# EAGLE schematic circuito_controle (EAGLE 9.6.2)
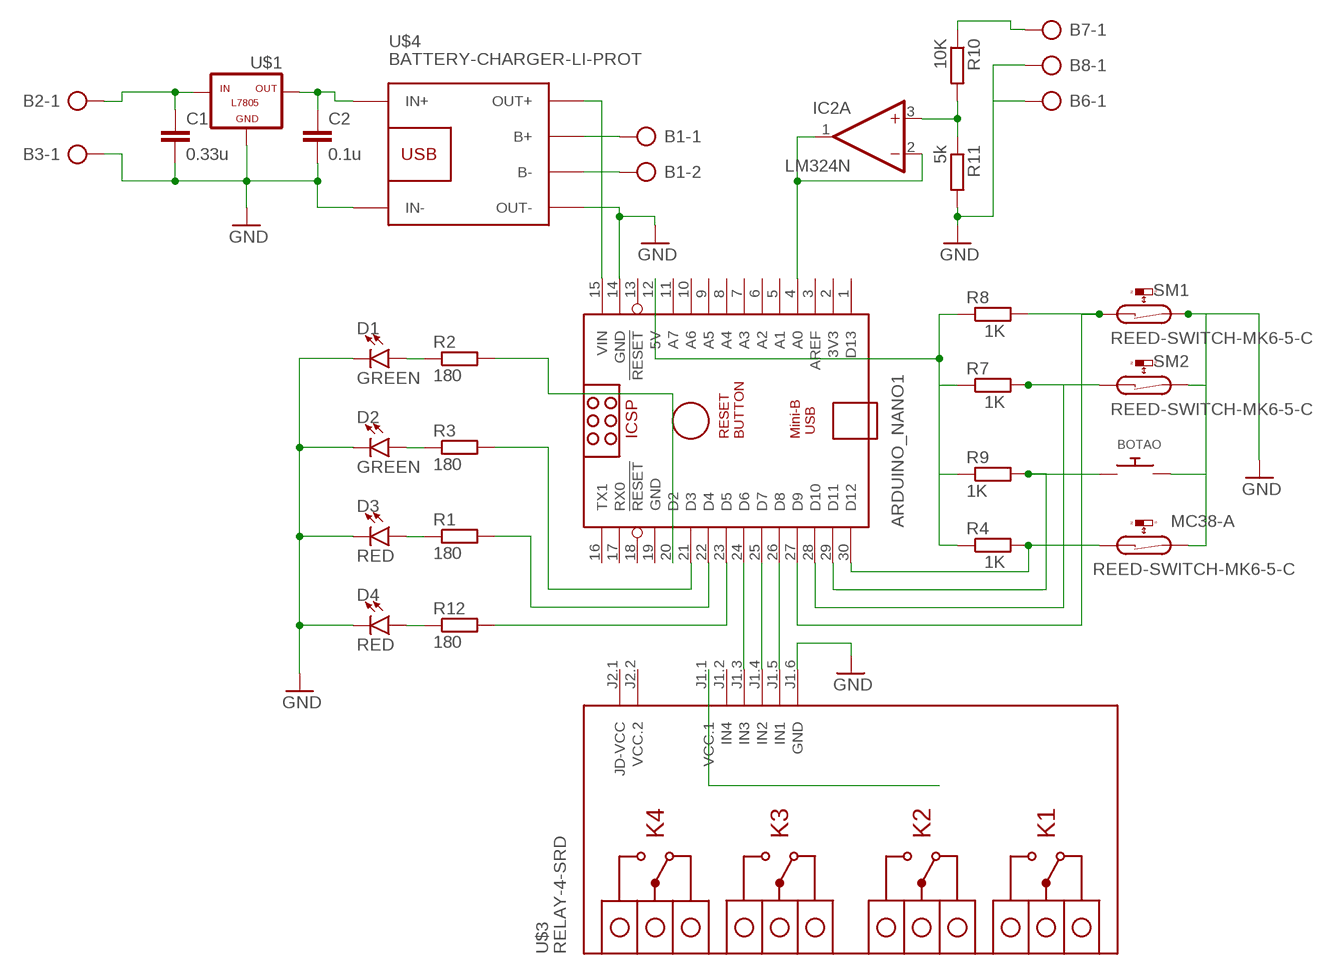
[diagram p0: schematic, sheet 1]

## Parts
ARDUINO_NANO1  ARDUINO_NANO  [ARDUINO_NANO]
B1  AK500/2-H  [AK500/2-H]
B2  AK500/2-H  [AK500/2-H]
B3  AK500/2-H  [AK500/2-H]
B6  AK500/2-H  [AK500/2-H]
B7  AK500/2-H  [AK500/2-H]
B8  AK500/2-H  [AK500/2-H]
BOTAO  SWITCH_PUSHBUTTONC&K_KSS  [BTN_CK_KSS]
C1  0.33u  C2.5/4  [C2.5-4]
C2  0.1u  C2.5/4  [C2.5-4]
D1  GREEN  LED-GREEN0603  [LED-0603]
D2  GREEN  LED-GREEN0603  [LED-0603]
D3  RED  LED-RED0603  [LED-0603]
D4  RED  LED-RED0603  [LED-0603]
IC2  LM324N  [DIL14]
MC38-A  REED-SWITCH-MK6-5-C  [MK6-5]
R1  180  R-EU_0204/5  [0204/5]
R2  180  R-EU_0204/5  [0204/5]
R3  180  R-EU_0204/5  [0204/5]
R4  1K  R-EU_0204/7  [0204/7]
R7  1K  R-EU_0204/7  [0204/7]
R8  1K  R-EU_0204/7  [0204/7]
R9  1K  R-EU_0204/7  [0204/7]
R10  10K  R-EU_0204/7  [0204/7]
R11  5k  R-EU_0204/7  [0204/7]
R12  180  R-EU_0204/5  [0204/5]
SM1  REED-SWITCH-MK6-5-C  [MK6-5]
SM2  REED-SWITCH-MK6-5-C  [MK6-5]
U$1  -L7805  [L7805]
U$3  RELAY-4-SRD  [RELAY-4-SRD]
U$4  BATTERY-CHARGER-LI-PROT  [BATTERY-CHARGER-LI-PROT]

## Nets
GND: ARDUINO_NANO1.14(GND) B3.1 B6.1 B8.1 BOTAO.P$2 C1.2 C2.2 D1.C D2.C D3.C D4.C MC38-A.2 R11.2 SM1.2 SM2.2 U$1.GND U$3.J1.6(GND) U$4.IN- U$4.OUT-
N$1: B1.2 U$4.B-
N$2: ARDUINO_NANO1.15(VIN) U$4.OUT+
N$3: B2.1 C1.1 U$1.IN
N$4: C2.1 U$1.OUT U$4.IN+
N$5: ARDUINO_NANO1.24(D6) U$3.J1.3(IN3)
N$6: ARDUINO_NANO1.25(D7) U$3.J1.4(IN2)
N$7: ARDUINO_NANO1.21(D3) R3.2
N$8: ARDUINO_NANO1.29(D11) BOTAO.P$1 R9.2
N$9: ARDUINO_NANO1.26(D8) U$3.J1.5(IN1)
N$10: D1.A R2.1
N$11: D2.A R3.1
N$12: D3.A R1.1
N$13: U$3.J1.1(VCC.1)
N$14: ARDUINO_NANO1.27(D9) R8.2 SM1.1
N$15: ARDUINO_NANO1.22(D4) R1.2
N$16: ARDUINO_NANO1.23(D5) R12.2
N$17: D4.A R12.1
N$18: ARDUINO_NANO1.20(D2) R2.2
N$19: ARDUINO_NANO1.4(A0) IC2.1(A:OUT) IC2.2(A:-IN)
N$20: ARDUINO_NANO1.28(D10) R7.2 SM2.1
N$23: B7.1 R10.1
N$25: ARDUINO_NANO1.12(5V) R4.1 R7.1 R8.1 R9.1
N$26: ARDUINO_NANO1.30(D12) MC38-A.1 R4.2
N$43: B1.1 U$4.B+
N$45: IC2.3(A:+IN) R10.2 R11.1
Unconnected: ARDUINO_NANO1.1(D13) ARDUINO_NANO1.2(3V3) ARDUINO_NANO1.3(AREF) ARDUINO_NANO1.5(A1) ARDUINO_NANO1.6(A2) ARDUINO_NANO1.7(A3) ARDUINO_NANO1.8(A4) ARDUINO_NANO1.9(A5) ARDUINO_NANO1.10(A6) ARDUINO_NANO1.11(A7) ARDUINO_NANO1.13(!RESET) ARDUINO_NANO1.16(TX1) ARDUINO_NANO1.17(RX0) ARDUINO_NANO1.18(!RESET) B2.2 B3.2 B6.2 B7.2 B8.2 IC2.5(B:+IN) IC2.6(B:-IN) IC2.7(B:OUT) IC2.8(C:OUT) IC2.9(C:-IN) IC2.10(C:+IN) IC2.12(D:+IN) IC2.13(D:-IN) IC2.14(D:OUT) U$3.J1.2(IN4) U$3.J2.1(JD-VCC)

## Power pins joined to a net without a drawn wire
GND: ARDUINO_NANO1.19(GND)
V+: IC2.4(P:V+)
V-: IC2.11(P:V-)
VCC.2: U$3.J2.2(VCC.2)

## Library data of the parts
ARDUINO_NANO1 = ArduinoNanoV30:ARDUINO_NANO: Arduino Nano V3.0 Overview: The Arduino Nano is a small, complete, and breadboard-friendly board based on the ATmega328 (Arduino Nano 3.x) or ATmega168 (Arduino Nano 2.x). It has more or less the same functionality of the Arduino Duemilanove, but in a different package. It lacks only a DC power jack, and works with a Mini-B USB cable instead of a standard one. The Nano was designed and is being produced by Gravitech. Specifications: Microcontroller Atmel ATmega168 or ATmega328 Operating Voltage (logic level) 5 V Input Voltage (recommended) 7-12 V Input Voltage (limits) 6-20 V Digital I/O Pins 14 (of which 6 provide PWM output) Analog Input Pins 8 DC Current per I/O Pin 40 mA Flash Memory 16 KB (ATmega168) or 32 KB (ATmega328) of which 2 KB used by bootloader SRAM 1 KB (ATmega168) or 2 KB (ATmega328) EEPROM 512 bytes (ATmega168) or 1 KB (ATmega328) Clock Speed 16 MHz Dimensions 0.73" x 1.70" Length 45 mm Width 18 mm Weigth 5 g Power: The Arduino Nano can be powered via the Mini-B USB connection, 6-20V unregulated external power supply (pin 30), or 5V regulated external power supply (pin 27). The power source is automatically selected to the highest voltage source. Memory: The ATmega168 has 16 KB of flash memory for storing code (of which 2 KB is used for the bootloader); the ATmega328 has 32 KB, (also with 2 KB used for the bootloader). The ATmega168 has 1 KB of SRAM and 512 bytes of EEPROM (which can be read and written with the EEPROM library); the ATmega328 has 2 KB of SRAM and 1 KB of EEPROM. Input and Output: Each of the 14 digital pins on the Nano can be used as an input or output, using pinMode(), digitalWrite(), and digitalRead() functions. They operate at 5 volts. Each pin can provide or receive a maximum of 40 mA and has an internal pull-up resistor (disconnected by default) of 20-50 kOhms. In addition, some pins have specialized functions. Visit Arduino - ArduinoBoardNano <https://www.arduino.cc/en/Main/ArduinoBoardNano>
B1-B3 B6-B8 = con-ptr500:AK500/2-H: CONNECTOR Aug. 2004 / PTR Meßtechnik: Die Bezeichnung der Serie AK505 wurde geändert. Es handelt sich hierbei um AK500 in horizontaler Ausführung.; OC_FARNELL: unknown; OC_NEWARK: unknown
BOTAO = adafruit:SWITCH_PUSHBUTTON: Buttons SOFTTOUCHSMD_SJ - Soft touch temporary push button (Super Junk Akihabara) Compatible with SKPMANE010 [Mouser: 688-SKPMAN] C&K_KSS = Digikey: KSS221GLFS
C1 C2 = capacitor-wima:C: CAPACITOR naming: grid - package width
D1 D2 = SparkFun-LED:LED-GREEN: Green SMD LED Used in manufacturing of various products at SparkFun Packages: 0603 - SMD 0603 package [Product Link] <http://www.futureelectronics.com/en/technologies/semiconductors/optoelectronics/leds/Pages/9894312-LTST-C190GKT.aspx?CrossPart=HSMG-C190&IM=0> LilyPad 1206 - SMD1206 LilyPad package [Product Link] <http://www.futureelectronics.com/en/Technologies/Product.aspx?ProductID=IN150NGHARVATEKCORPORATION2049943&IM=0> 1206 - SMD1206 package [Product Link] <http://www.futureelectronics.com/en/technologies/semiconductors/optoelectronics/leds/Pages/8315665-LTST-C150KGKT.aspx?IM=0> 1206 Bottom Mount -SMD 1206 Bottom Mount [Product Link] <http://www.digikey.com/product-detail/en/lite-on-inc/LTST-C230KGKT/160-1456-1-ND/386854> SparkFun Products: Pro Mini 328 -5V <https://www.sparkfun.com/products/821> RedBoard <https://www.sparkfun.com/products/12757> MP3 Trigger <https://www.sparkfun.com/products/13720> Makey Makey <https://www.sparkfun.com/products/11076>; PROD_ID: DIO-00821
D3 D4 = SparkFun-LED:LED-RED: Red SMD LED Used in manufacturing of most products at SparkFun Packages: 0603 - SMD 0603 package [Product Link] <http://docs.avagotech.com/docs/AV02-0551EN> 0603 SMART - SMD 0603 SMART package ( more efficient and expensive)[Product Link] <http://www.osram-os.com/Graphics/XPic2/00077099_0.pdf> 1206 - SMD1206 package [Product Link] <https://www.sparkfun.com/datasheets/DevTools/LilyPad/Q150OVS4.pdff> SparkFun Products: Pro Mini 328 -5V <https://www.sparkfun.com/products/821> RedBoard <https://www.sparkfun.com/products/12757> IOIO-OTG <https://www.sparkfun.com/products/13613>; PROD_ID: DIO-00819
IC2 = linear:LM324: OP AMP
MC38-A SM1 SM2 = switch-reed:REED-SWITCH-: Reed Sensor; MF: MEDER; MPN: MK6-5-C; OC_FARNELL: 1079480
R1-R3 R12 = rcl:R-EU_: RESISTOR, European symbol; SPICEPREFIX: R
R4 R7-R11 = resistor:R-EU_: RESISTOR, European symbol
U$1 = tango:-L7805
U$3 = diy-modules:RELAY-4-SRD: 4-Channel Relay Module based on SRD-05VDC-SL-C relays Click here to find device on ebay.com <http://www.ebay.com/sch/four+channel+relay+module+optocoupler+5v>
U$4 = diy-modules_1:BATTERY-CHARGER-LI-PROT: Lithium Battery 5V Charger with protection circuit More details available here: http://www.instructables.com/id/DIY-Lithium-ion-Battery-Charger/step4/TP4056-based-lithium-ion-battery-charger-module/ Click here to find device on ebay.com <http://www.ebay.com/sch/tp4056+charger+usb+protection>